# EAGLE design untitled (EAGLE 6.3)

## Sheet 1 of 2
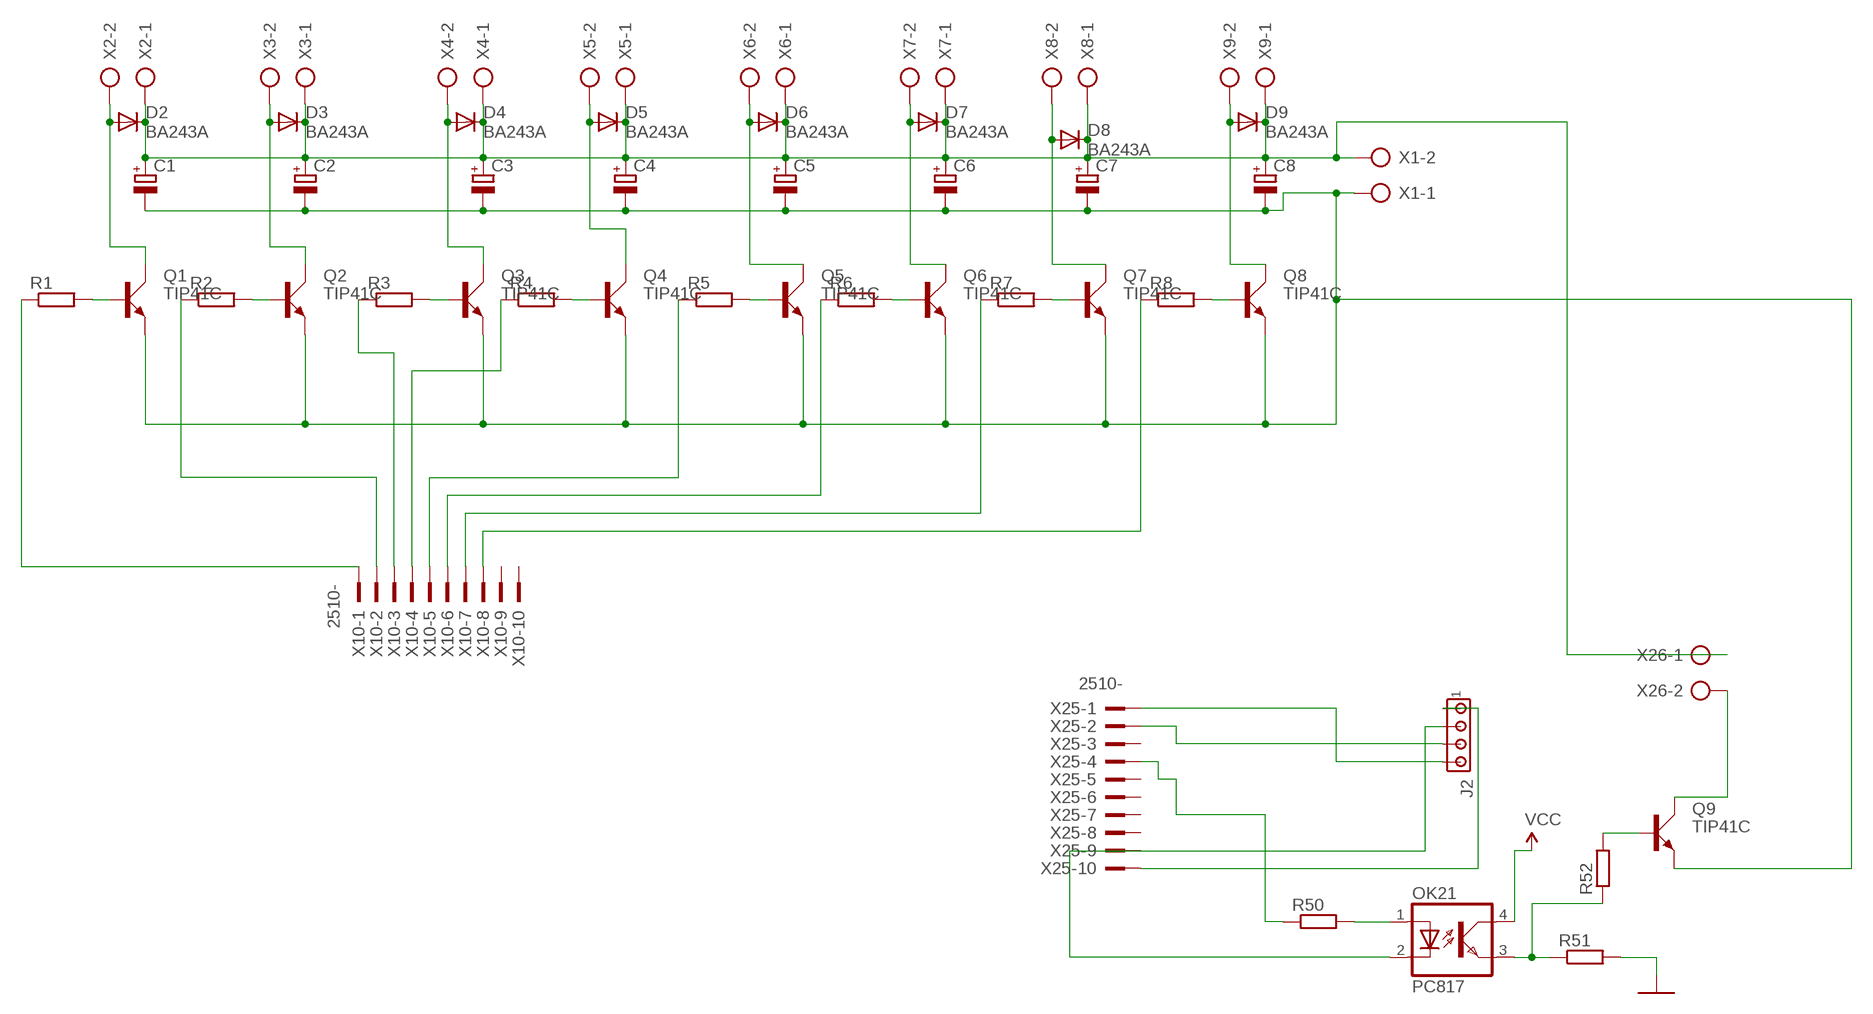
[diagram p0: schematic, sheet 1]

### Parts
C1  CPOL-EUE5-10.5  [E5-10,5]
C2  CPOL-EUE5-10.5  [E5-10,5]
C3  CPOL-EUE5-10.5  [E5-10,5]
C4  CPOL-EUE5-10.5  [E5-10,5]
C5  CPOL-EUE5-10.5  [E5-10,5]
C6  CPOL-EUE5-10.5  [E5-10,5]
C7  CPOL-EUE5-10.5  [E5-10,5]
C8  CPOL-EUE5-10.5  [E5-10,5]
D2  BA243A  [DO35-10]
D3  BA243A  [DO35-10]
D4  BA243A  [DO35-10]
D5  BA243A  [DO35-10]
D6  BA243A  [DO35-10]
D7  BA243A  [DO35-10]
D8  BA243A  [DO35-10]
D9  BA243A  [DO35-10]
J2  MTA04-100  [10X04MTA]
OK21  PC817  [DIL04]
Q1  TIP41C  [TO220AV]
Q2  TIP41C  [TO220AV]
Q3  TIP41C  [TO220AV]
Q4  TIP41C  [TO220AV]
Q5  TIP41C  [TO220AV]
Q6  TIP41C  [TO220AV]
Q7  TIP41C  [TO220AV]
Q8  TIP41C  [TO220AV]
Q9  TIP41C  [TO220AV]
R1  R-EU_0204/7  [0204/7]
R2  R-EU_0204/7  [0204/7]
R3  R-EU_0204/7  [0204/7]
R4  R-EU_0204/7  [0204/7]
R5  R-EU_0204/7  [0204/7]
R6  R-EU_0204/7  [0204/7]
R7  R-EU_0204/7  [0204/7]
R8  R-EU_0204/7  [0204/7]
R50  R-EU_0204/7  [0204/7]
R51  R-EU_0204/7  [0204/7]
R52  R-EU_0204/7  [0204/7]
X1  AK300/2  [AK300/2]
X2  AK300/2  [AK300/2]
X3  AK300/2  [AK300/2]
X4  AK300/2  [AK300/2]
X5  AK300/2  [AK300/2]
X6  AK300/2  [AK300/2]
X7  AK300/2  [AK300/2]
X8  AK300/2  [AK300/2]
X9  AK300/2  [AK300/2]
X10  2510-  [PAK100/2500-10]
X25  2510-  [PAK100/2500-10]
X26  AK300/2  [AK300/2]

### Nets
GND: R51.2 ; also sheet 2
N$1: Q1.B R1.2
N$2: Q2.B R2.2
N$3: Q3.B R3.2
N$4: Q4.B R4.2
N$5: Q5.B R5.2
N$6: Q7.B R7.2
N$7: Q8.B R8.2
N$8: Q6.B R6.2
N$10: D2.A Q1.C X2.2
N$11: D3.A Q2.C X3.2
N$12: D4.A Q3.C X4.2
N$13: D5.A Q4.C X5.2
N$14: D6.A Q5.C X6.2
N$15: D7.A Q6.C X7.2
N$16: D8.A Q7.C X8.2
N$17: D9.A Q8.C X9.2
N$18: C1.+ C2.+ C3.+ C4.+ C5.+ C6.+ C7.+ C8.+ D2.C D3.C D4.C D5.C D6.C D7.C D8.C D9.C X1.2 X2.1 X3.1 X4.1 X5.1 X6.1 X7.1 X8.1 X9.1 X26.1
N$19: R3.1 X10.3
N$20: R4.1 X10.4
N$21: R1.1 X10.1
N$22: R2.1 X10.2
N$23: R5.1 X10.5
N$24: R6.1 X10.6
N$25: R7.1 X10.7
N$26: R8.1 X10.8
N$149: J2.1 X25.10
N$150: J2.2 OK21.2(C) X25.9
N$151: J2.3 X25.2
N$152: J2.4 X25.1
N$153: OK21.1(A) R50.2
N$154: R50.1 X25.4
N$156: OK21.3(EMIT) R51.1 R52.1
N$157: Q9.B R52.2
N$159: Q9.C X26.2
N$160: C1.- C2.- C3.- C4.- C5.- C6.- C7.- C8.- Q1.E Q2.E Q3.E Q4.E Q5.E Q6.E Q7.E Q8.E Q9.E X1.1
VCC: OK21.4(COL) ; also sheet 2
Unconnected: X10.9 X10.10 X25.3 X25.5 X25.6 X25.7 X25.8

## Sheet 2 of 2
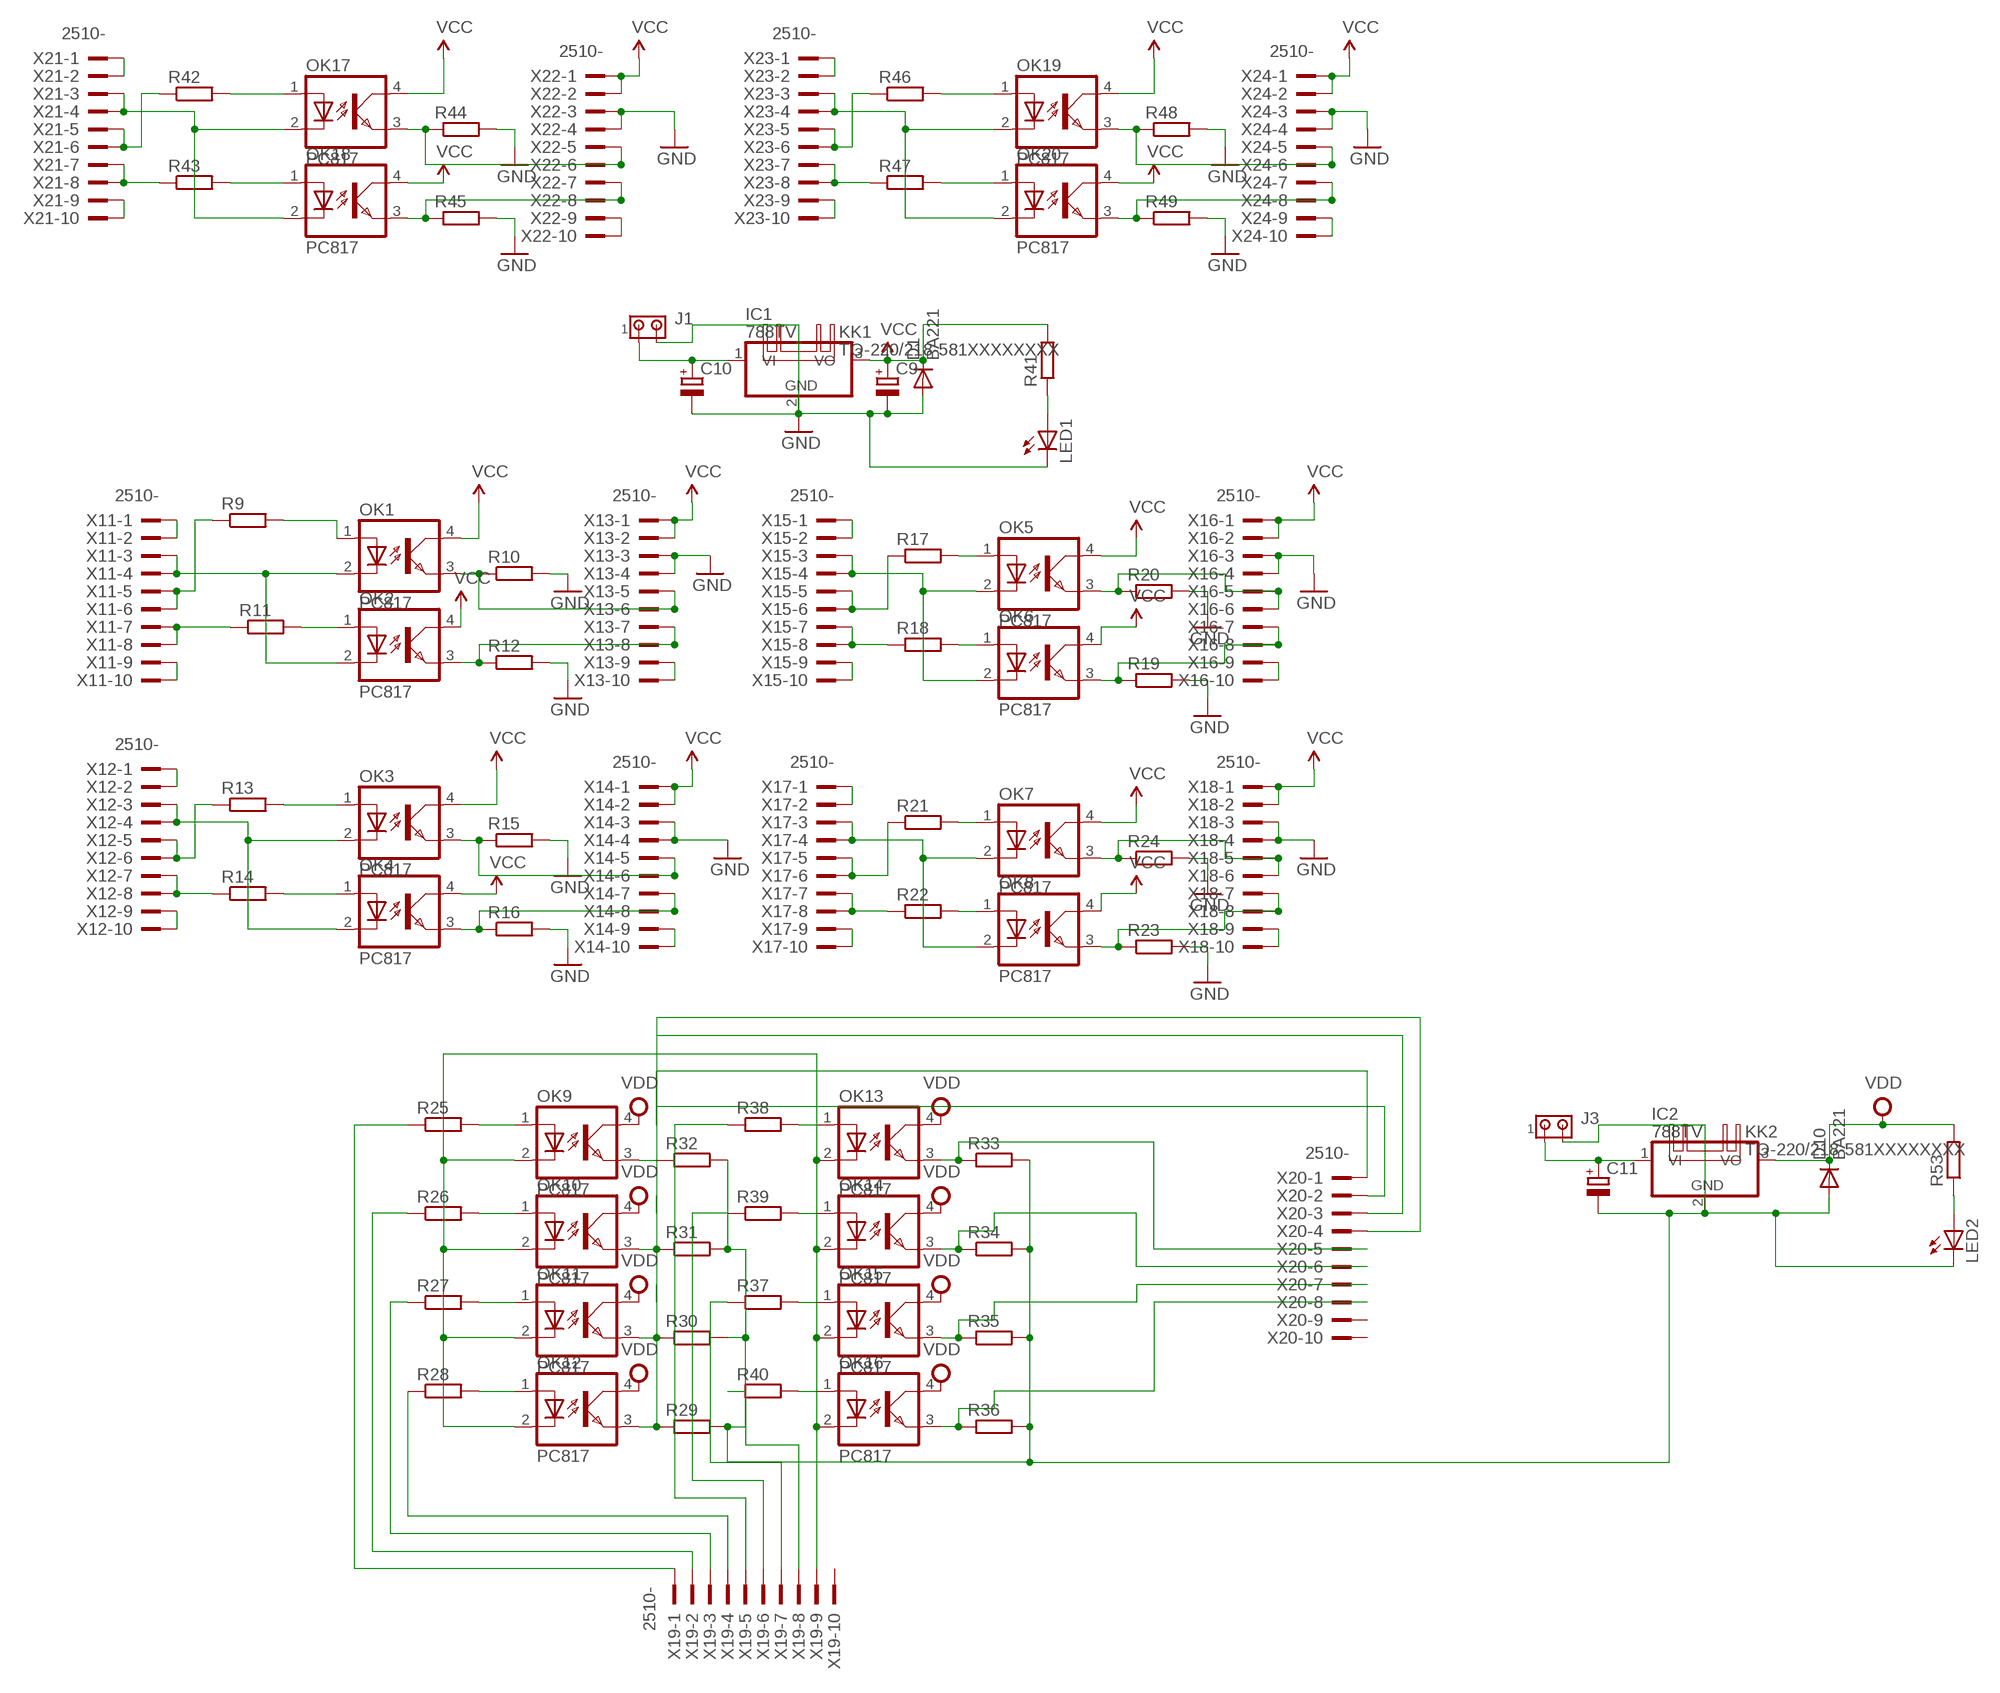
[diagram p1: schematic, sheet 2]

### Parts
C9  CPOL-EUE5-10.5  [E5-10,5]
C10  CPOL-EUE7.5-18  [E7,5-18]
C11  CPOL-EUE7.5-18  [E7,5-18]
D1  BA221  [DO35-10]
D10  BA221  [DO35-10]
IC1  788TV  [TO220V]
IC2  788TV  [TO220V]
J1  MTA02-156  [1X2MTA]
J3  MTA02-156  [1X2MTA]
KK1  TO-220/218-581XXXXXXXX  [581XXXXXXXX]
KK2  TO-220/218-581XXXXXXXX  [581XXXXXXXX]
LED1  LEDSFH480  [SFH480]
LED2  LEDSFH480  [SFH480]
OK1  PC817  [DIL04]
OK2  PC817  [DIL04]
OK3  PC817  [DIL04]
OK4  PC817  [DIL04]
OK5  PC817  [DIL04]
OK6  PC817  [DIL04]
OK7  PC817  [DIL04]
OK8  PC817  [DIL04]
OK9  PC817  [DIL04]
OK10  PC817  [DIL04]
OK11  PC817  [DIL04]
OK12  PC817  [DIL04]
OK13  PC817  [DIL04]
OK14  PC817  [DIL04]
OK15  PC817  [DIL04]
OK16  PC817  [DIL04]
OK17  PC817  [DIL04]
OK18  PC817  [DIL04]
OK19  PC817  [DIL04]
OK20  PC817  [DIL04]
R9  R-EU_0207/10  [0207/10]
R10  R-EU_0207/10  [0207/10]
R11  R-EU_0207/10  [0207/10]
R12  R-EU_0207/10  [0207/10]
R13  R-EU_0207/10  [0207/10]
R14  R-EU_0207/10  [0207/10]
R15  R-EU_0207/10  [0207/10]
R16  R-EU_0207/10  [0207/10]
R17  R-EU_0207/10  [0207/10]
R18  R-EU_0207/10  [0207/10]
R19  R-EU_0207/10  [0207/10]
R20  R-EU_0207/10  [0207/10]
R21  R-EU_0207/10  [0207/10]
R22  R-EU_0207/10  [0207/10]
R23  R-EU_0207/10  [0207/10]
R24  R-EU_0207/10  [0207/10]
R25  R-EU_0207/10  [0207/10]
R26  R-EU_0207/10  [0207/10]
R27  R-EU_0207/10  [0207/10]
R28  R-EU_0207/10  [0207/10]
R29  R-EU_0207/10  [0207/10]
R30  R-EU_0207/10  [0207/10]
R31  R-EU_0207/10  [0207/10]
R32  R-EU_0207/10  [0207/10]
R33  R-EU_0207/10  [0207/10]
R34  R-EU_0207/10  [0207/10]
R35  R-EU_0207/10  [0207/10]
R36  R-EU_0207/10  [0207/10]
R37  R-EU_0207/10  [0207/10]
R38  R-EU_0207/10  [0207/10]
R39  R-EU_0207/10  [0207/10]
R40  R-EU_0207/10  [0207/10]
R41  R-EU_0207/10  [0207/10]
R42  R-EU_0207/10  [0207/10]
R43  R-EU_0207/10  [0207/10]
R44  R-EU_0207/10  [0207/10]
R45  R-EU_0207/10  [0207/10]
R46  R-EU_0207/10  [0207/10]
R47  R-EU_0207/10  [0207/10]
R48  R-EU_0207/10  [0207/10]
R49  R-EU_0207/10  [0207/10]
R53  R-EU_0207/10  [0207/10]
X11  2510-  [PAK100/2500-10]
X12  2510-  [PAK100/2500-10]
X13  2510-  [PAK100/2500-10]
X14  2510-  [PAK100/2500-10]
X15  2510-  [PAK100/2500-10]
X16  2510-  [PAK100/2500-10]
X17  2510-  [PAK100/2500-10]
X18  2510-  [PAK100/2500-10]
X19  2510-  [PAK100/2500-10]
X20  2510-  [PAK100/2500-10]
X21  2510-  [PAK100/2500-10]
X22  2510-  [PAK100/2500-10]
X23  2510-  [PAK100/2500-10]
X24  2510-  [PAK100/2500-10]

### Nets
GND: C9.- C10.- D1.A IC1.2(GND) J1.2 LED1.K(C) R10.2 R12.2 R15.2 R16.2 R19.2 R20.2 R23.2 R24.2 R44.2 R45.2 R48.2 R49.2 X13.3 X13.4 X14.3 X14.4 X16.3 X16.4 X18.3 X18.4 X22.3 X22.4 X24.3 X24.4 ; also sheet 1
N$9: X11.1 X11.2
N$27: R9.1 X11.5 X11.6
N$28: R11.1 X11.7 X11.8
N$29: X11.9 X11.10
N$31: X12.1 X12.2
N$32: R13.1 X12.5 X12.6
N$33: R14.1 X12.7 X12.8
N$34: X12.9 X12.10
N$41: OK1.1(A) R9.2
N$42: OK2.1(A) R11.2
N$60: OK1.2(C) OK2.2(C) X11.3 X11.4
N$61: OK2.3(EMIT) R12.1 X13.7 X13.8
N$62: X13.9 X13.10
N$63: OK3.1(A) R13.2
N$64: OK4.1(A) R14.2
N$65: OK3.2(C) OK4.2(C) X12.3 X12.4
N$66: OK3.3(EMIT) R15.1 X14.5 X14.6
N$67: OK4.3(EMIT) R16.1 X14.7 X14.8
N$68: X14.9 X14.10
N$69: OK5.1(A) R17.2
N$70: OK6.1(A) R18.2
N$71: X15.1 X15.2
N$72: R17.1 X15.5 X15.6
N$73: R18.1 X15.7 X15.8
N$74: X15.9 X15.10
N$75: OK5.2(C) OK6.2(C) X15.3 X15.4
N$76: OK5.3(EMIT) R20.1 X16.5 X16.6
N$77: OK6.3(EMIT) R19.1 X16.7 X16.8
N$78: X16.9 X16.10
N$79: OK7.1(A) R21.2
N$80: OK8.1(A) R22.2
N$81: X17.1 X17.2
N$82: R21.1 X17.5 X17.6
N$83: R22.1 X17.7 X17.8
N$84: X17.9 X17.10
N$85: OK7.2(C) OK8.2(C) X17.3 X17.4
N$86: OK7.3(EMIT) R24.1 X18.5 X18.6
N$87: OK8.3(EMIT) R23.1 X18.7 X18.8
N$88: X18.9 X18.10
N$89: R25.1 X19.1
N$90: OK9.1(A) R25.2
N$91: R26.1 X19.2
N$92: R27.1 X19.3
N$93: R28.1 X19.4
N$94: OK12.1(A) R28.2
N$95: OK11.1(A) R27.2
N$96: OK10.1(A) R26.2
N$97: OK9.2(C) OK10.2(C) OK11.2(C) OK12.2(C) OK13.2(C) OK14.2(C) OK15.2(C) OK16.2(C) X19.9
N$98: X20.1
N$99: OK10.3(EMIT) R31.1 X20.2
N$100: OK11.3(EMIT) R30.1 X20.3
N$101: OK12.3(EMIT) R29.1 X20.4
N$102: OK13.1(A) R38.2
N$103: OK14.1(A) R39.2
N$104: OK15.1(A) R37.2
N$105: OK16.1(A) R40.2
N$106: R38.1 X19.5
N$107: R39.1 X19.6
N$108: R37.1 X19.7
N$109: R40.1 X19.8
N$110: OK15.3(EMIT) R35.1 X20.7
N$111: OK16.3(EMIT) R36.1 X20.8
N$112: OK14.3(EMIT) R34.1 X20.6
N$113: OK13.3(EMIT) R33.1 X20.5
N$114: C10.+ IC1.1(VI) J1.1
N$115: LED1.A R41.1
N$116: OK1.3(EMIT) R10.1 X13.5 X13.6
N$117: X21.1 X21.2
N$118: R42.1 X21.5 X21.6
N$119: R43.1 X21.7 X21.8
N$120: X21.9 X21.10
N$121: OK17.1(A) R42.2
N$122: OK18.1(A) R43.2
N$123: OK17.2(C) OK18.2(C) X21.3 X21.4
N$124: OK17.3(EMIT) R44.1 X22.5 X22.6
N$125: OK18.3(EMIT) R45.1 X22.7 X22.8
N$126: X22.9 X22.10
N$127: X23.1 X23.2
N$128: R46.1 X23.5 X23.6
N$129: R47.1 X23.7 X23.8
N$130: X23.9 X23.10
N$131: OK19.1(A) R46.2
N$132: OK20.1(A) R47.2
N$133: OK19.2(C) OK20.2(C) X23.3 X23.4
N$134: OK19.3(EMIT) R48.1 X24.5 X24.6
N$135: OK20.3(EMIT) R49.1 X24.7 X24.8
N$136: X24.9 X24.10
N$137: C11.+ IC2.1(VI) J3.1
N$155: LED2.A R53.1
N$162: OK9.3(EMIT) R32.1
N$165: C11.- D10.A IC2.2(GND) J3.2 LED2.K(C) R29.2 R30.2 R31.2 R32.2 R33.2 R34.2 R35.2 R36.2
VCC: C9.+ D1.C IC1.3(VO) OK1.4(COL) OK2.4(COL) OK3.4(COL) OK4.4(COL) OK5.4(COL) OK6.4(COL) OK7.4(COL) OK8.4(COL) OK17.4(COL) OK18.4(COL) OK19.4(COL) OK20.4(COL) R41.2 X13.1 X13.2 X14.1 X14.2 X16.1 X16.2 X18.1 X18.2 X22.1 X22.2 X24.1 X24.2 ; also sheet 1
VDD: D10.C IC2.3(VO) OK9.4(COL) OK10.4(COL) OK11.4(COL) OK12.4(COL) OK13.4(COL) OK14.4(COL) OK15.4(COL) OK16.4(COL) R53.2
Unconnected: X19.10 X20.9 X20.10

## Library data of the parts
C1-C8 = rcl:CPOL-EU: POLARIZED CAPACITOR, European symbol
C9-C11 = qfm-trx1-24g:CPOL-EU: POLARIZED CAPACITOR, European symbol
D1 D10 = diode:BA221: DIODE high speed (Philips)
D2-D9 = diode:BA243A: DIODE
IC1 IC2 = linear:78*: Positive VOLTAGE REGULATOR Source: http://cache.national.com/ds/LM/LM78L05.pdf http://www.fairchildsemi.com/ds/LM/LM7805.pdf
J1 J3 = con-amp:MTA02-156: AMP connector
J2 = con-amp:MTA04-100: AMP connector
KK1 KK2 = heatsink-aavid:TO-220/218: HEATSINKS TO-220/218
LED1 LED2 = adafruit:LED: LED OSRAM: - CHIPLED LG R971, LG N971, LY N971, LG Q971, LY Q971, LO R971, LY R971 LH N974, LH R974 LS Q976, LO Q976, LY Q976 LO Q996 - Hyper CHIPLED LW Q18S LB Q993, LB Q99A, LB R99A - SideLED LS A670, LO A670, LY A670, LG A670, LP A670 LB A673, LV A673, LT A673, LW A673 LH A674 LY A675 LS A676, LA A676, LO A676, LY A676, LW A676 LS A679, LY A679, LG A679 - Hyper Micro SIDELED® LS Y876, LA Y876, LO Y876, LY Y876 LT Y87S - SmartLED LW L88C, LW L88S LB L89C, LB L89S, LG L890 LS L89K, LO L89K, LY L89K LS L896, LA L896, LO L896, LY L896 - TOPLED LS T670, LO T670, LY T670, LG T670, LP T670 LSG T670, LSP T670, LSY T670, LOP T670, LYG T670 LG T671, LOG T671, LSG T671 LB T673, LV T673, LT T673, LW T673 LH T674 LS T676, LA T676, LO T676, LY T676, LB T676, LH T676, LSB T676, LW T676 LB T67C, LV T67C, LT T67C, LS T67K, LO T67K, LY T67K, LW E67C LS E67B, LA E67B, LO E67B, LY E67B, LB E67C, LV E67C, LT E67C LW T67C LS T679, LY T679, LG T679 LS T770, LO T770, LY T770, LG T770, LP T770 LB T773, LV T773, LT T773, LW T773 LH T774 LS E675, LA E675, LY E675, LS T675 LS T776, LA T776, LO T776, LY T776, LB T776 LHGB T686 LT T68C, LB T68C - Hyper Mini TOPLED® LB M676 - Mini TOPLED Santana® LG M470 LS M47K, LO M47K, LY M47K Source: http://www.osram.convergy.de/
OK1-OK21 = optocoupler:PC817: SHARP OPTO COUPLER; MPN: PC817X4J000F; OC_FARNELL: 9707727; OC_NEWARK: 97K7059
Q1-Q9 = transistor-power:TIP41C: NPN TRANSISTOR
R1-R53 = rcl:R-EU_: RESISTOR, European symbol
X1-X9 X26 = con-ptr500:AK300/2: CONNECTOR
X10-X25 = con-3m:2510-: 3M (TM) Pak 100 4-Wall Header Source: 3M; MF: 3M; MPN: 2510-6002UB; OC_FARNELL: 9838244; OC_NEWARK: 46F4725

## Board
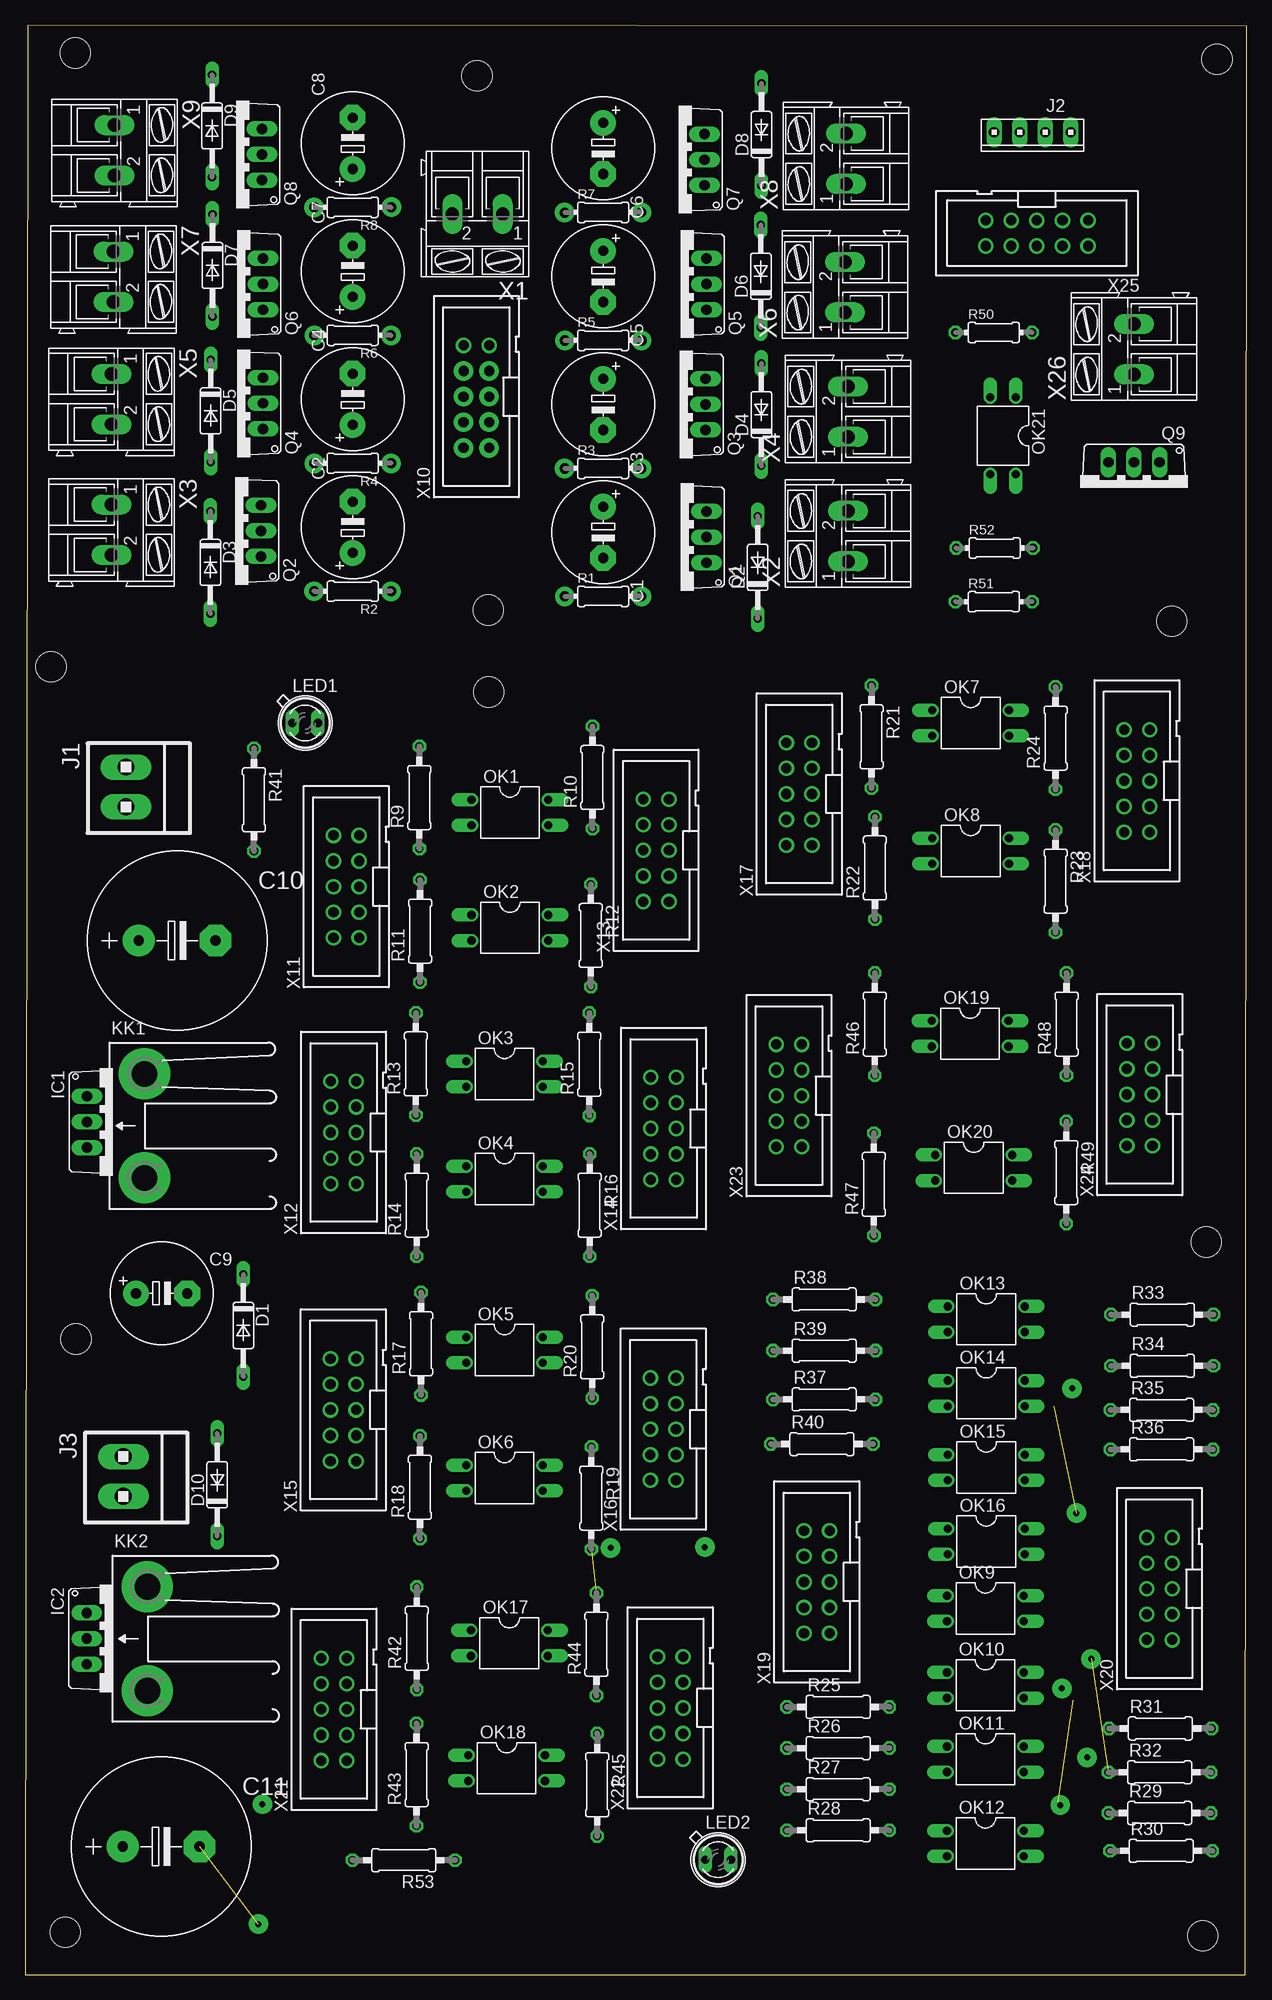
[diagram p2: board, top side]
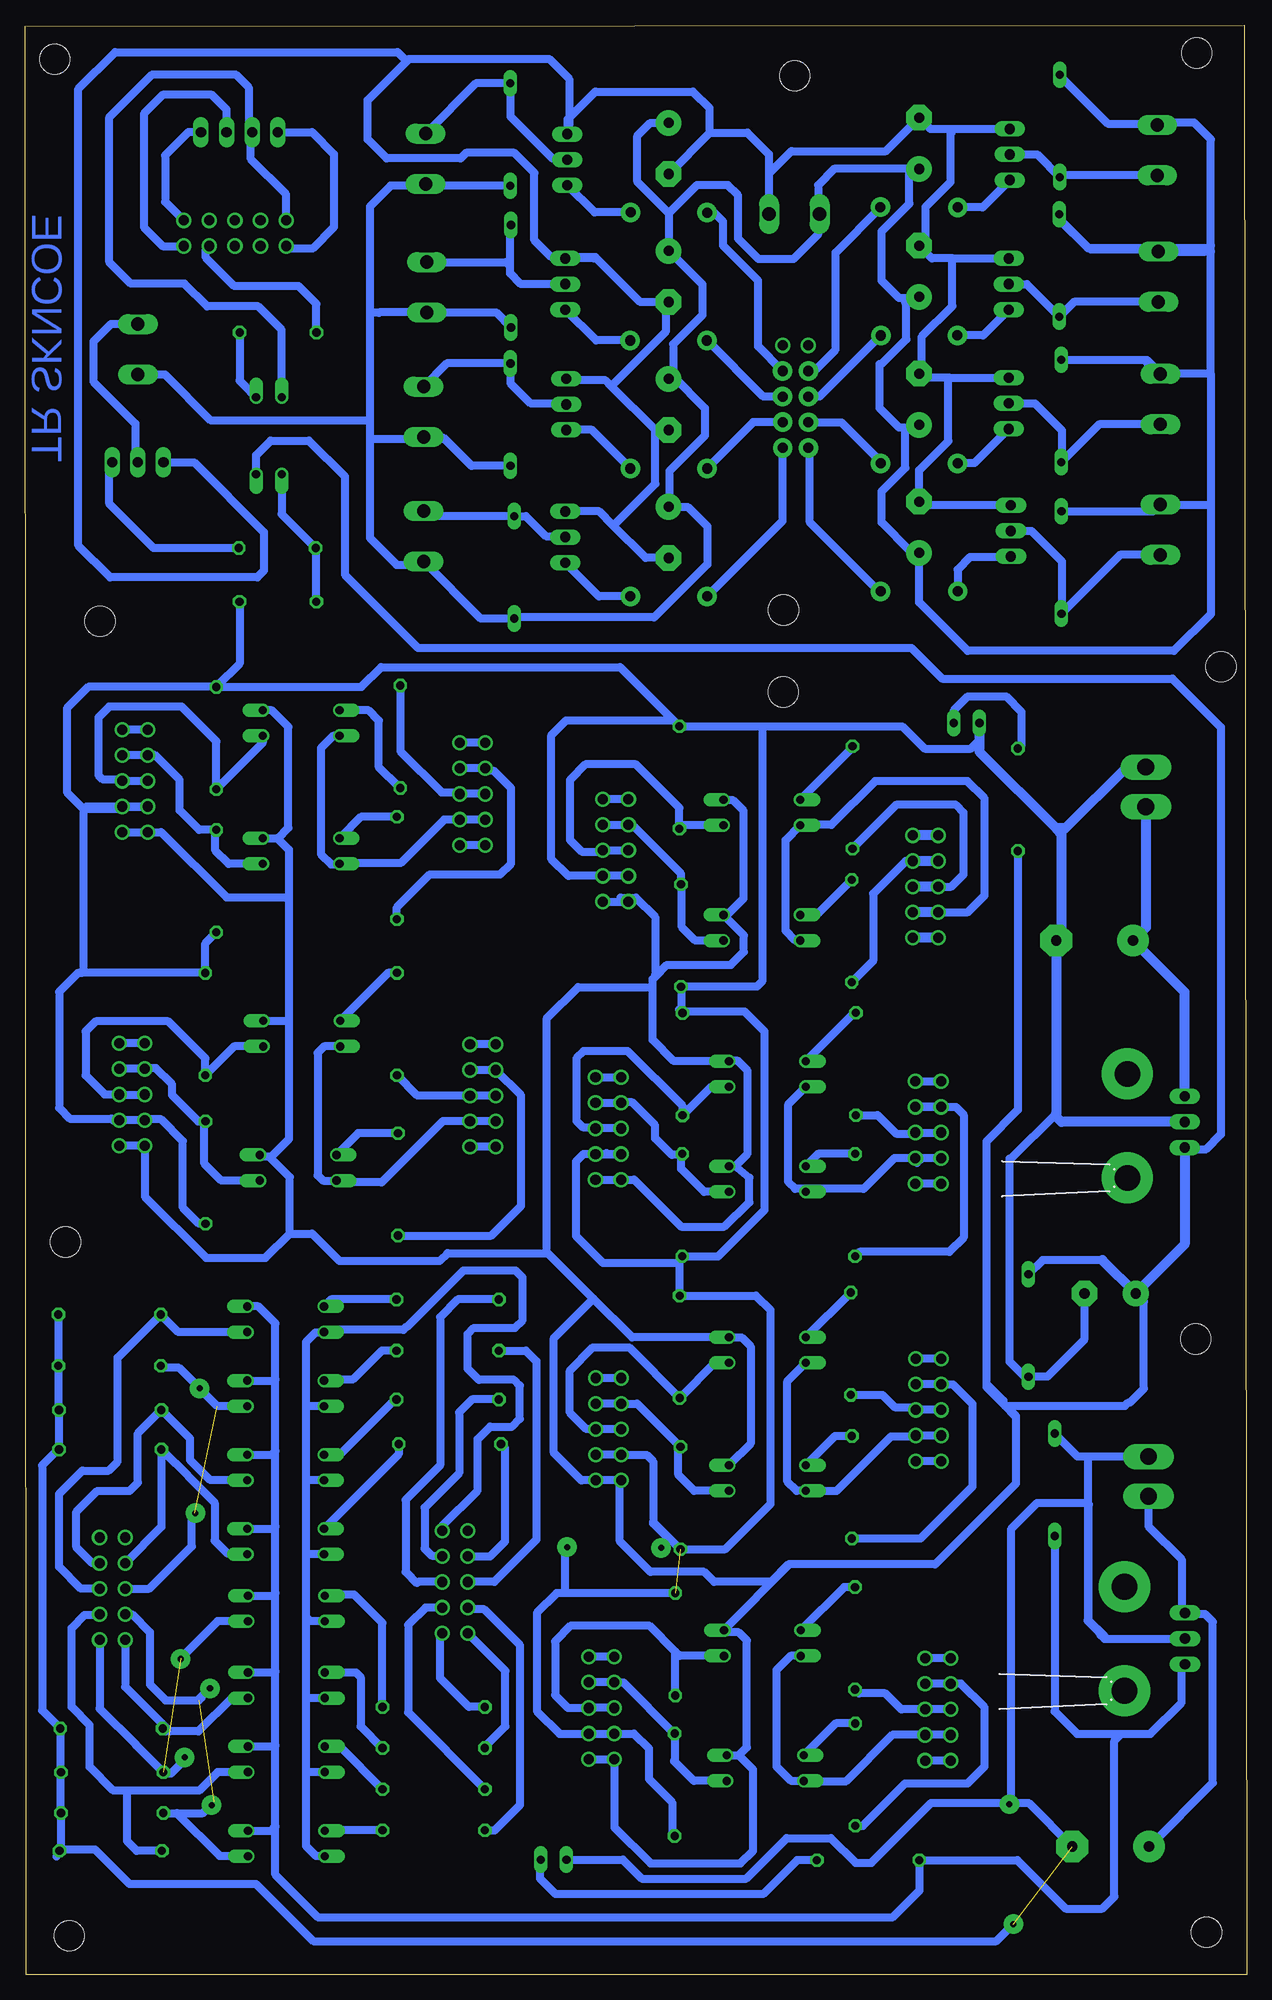
[diagram p3: board, bottom side, seen from below]

Size 121.2 x 193.46 mm. Coordinates in mm from the lower left corner, seen from the top.
Outline: 0,0 121.08,0.03 121.2,193.36 0.25,193.46 0,0
Copper layers (1*16): Top 0.035mm / dielectric 1.5mm / Bottom 0.035mm
Design rules "default": minimum track width 10mil, minimum drill 24mil, track to track 8mil, track to pad 8mil, pad to pad 8mil, via to via 8mil, smd to smd 8mil, copper to edge 40mil, drill to drill 8mil, minimum pad ring 10mil, minimum via ring 8mil, stop-mask expansion 4mil, vias tented up to drill 0mil, thermal gap 10mil
Holes 3 mm at 44.83,188.46 45.95,135.43 113.78,134.31 4.96,190.7 3.98,4.23 116.84,3.87 2.55,129.8 45.99,127.3 118.26,190.09 117.19,72.72 5.05,63.09

### Footprints (pad centres in the part's own frame; a part is rotated, then mirrored left to right if it is on the bottom)
E5-10,5 = drill 1.016 pad 2.54: + -2.54,0 | drill 1.016 pad 2.54 octagon: - 2.54,0
E7,5-18 = drill 1.016 pad 3.15: + -3.81,0 | drill 1.016 pad 3.15 octagon: - 3.81,0
DO35-10 = drill 0.813 long: A 5.08,0; C -5.08,0
TO220V = drill 1.016 long: 1 -2.54,-2.54; 2 0,-2.54; 3 2.54,-2.54
1X2MTA = drill 1.676 long: 1 1.981,0; 2 -1.981,0
10X04MTA = drill 1.016 long: 1 3.81,0; 2 1.27,0; 3 -1.27,0; 4 -3.81,0
581XXXXXXXX = drill 2.54 pad 5.08: A2,5 -5.16,3.45; B2,5 5.16,3.45
SFH480 = drill 0.813 long: A 1.27,0; K -1.27,0
DIL04 = drill 0.813 offset: 1 -1.27,-3.81; 2 1.27,-3.81; 3 1.27,3.81; 4 -1.27,3.81
TO220AV = drill 1.016 long: B -2.54,-2.54; C 0,-2.54; E 2.54,-2.54
0204/7 = drill 0.813 octagon: 1 -3.81,0; 2 3.81,0
0207/10 = drill 0.813 octagon: 1 -5.08,0; 2 5.08,0
AK300/2 = drill 1.321 long: 1 -2.515,0; 2 2.489,0
PAK100/2500-10 = drill 1 pad 1.422: 1 -5.08,-1.27; 2 -5.08,1.27; 3 -2.54,-1.27; 4 -2.54,1.27; 5 0,-1.27; 6 0,1.27; 7 2.54,-1.27; 8 2.54,1.27; 9 5.08,-1.27; 10 5.08,1.27

### Placement (x,y rotation side)
C1  57.35,143.13 270 top
C2  32.49,143.64 90 top
C3  57.35,155.83 270 top
C4  32.49,156.34 90 top
C5  57.35,168.53 270 top
C6  57.35,181.23 270 top
C7  32.49,169.04 90 top
C8  32.49,181.74 90 top
C9  13.54,67.61 0 top
C10  15.08,102.63 0 top
C11  13.49,12.72 0 top
D1  21.65,64.43 270 top
D2  72.69,139.66 90 top
D3  18.38,140.15 270 top
D4  73.05,154.82 90 top
D5  18.4,155.18 270 top
D6  73,168.55 90 top
D7  18.58,169.62 270 top
D8  73.06,182.61 90 top
D9  18.55,183.46 270 top
D10  19.05,48.63 90 top
IC1  8.68,84.63 270 top
IC2  8.65,33.37 270 top
J1  10,117.87 270 top
J2  99.95,182.84 180 top
J3  9.74,49.45 270 top
KK1  8.38,84.24 270 top
KK2  8.67,33.34 270 top
LED1  27.78,124.22 0 top
LED2  68.76,11.43 0 top
OK1  48.1,115.33 270 top
OK2  48.1,103.9 270 top
OK3  47.56,89.39 270 top
OK4  47.56,78.96 270 top
OK5  47.56,61.99 270 top
OK6  47.56,49.29 270 top
OK7  93.82,124.22 270 top
OK8  93.82,111.52 270 top
OK9  95.29,36.36 270 top
OK10  95.29,28.74 270 top
OK11  95.29,21.39 270 top
OK12  95.29,13.04 270 top
OK13  95.36,65.05 270 top
OK14  95.36,57.7 270 top
OK15  95.36,50.35 270 top
OK16  95.36,43 270 top
OK17  48.04,32.91 270 top
OK18  47.77,20.51 270 top
OK19  93.76,93.39 270 top
OK20  94.12,80.09 270 top
OK21  97.02,152.73 180 top
Q1  65.07,142.67 90 top
Q2  20.86,143.28 90 top
Q3  64.97,155.83 90 top
Q4  21.06,155.94 90 top
Q5  65.07,167.77 90 top
Q6  21.06,167.77 90 top
Q7  64.87,180.12 90 top
Q8  20.96,180.63 90 top
Q9  110.03,147.55 180 top
R1  57.35,136.78 0 top
R2  32.49,137.29 180 top
R3  57.35,149.48 0 top
R4  32.49,149.99 180 top
R5  57.35,162.18 0 top
R6  32.49,162.69 180 top
R7  57.35,174.88 0 top
R8  32.49,175.39 180 top
R9  39.12,116.82 90 top
R10  56.29,118.81 90 top
R11  39.18,103.57 90 top
R12  56.13,103.13 270 top
R13  38.77,90.38 90 top
R14  38.85,76.38 90 top
R15  55.97,90.36 90 top
R16  56.01,76.38 270 top
R17  39.28,62.62 90 top
R18  39.17,48.38 90 top
R19  56.18,47.31 270 top
R20  56.26,62.31 90 top
R21  83.98,122.85 270 top
R22  84.32,109.83 90 top
R23  102.24,108.53 270 top
R24  102.24,122.72 90 top
R25  80.67,26.58 0 top
R26  80.67,22.5 0 top
R27  80.67,18.42 0 top
R28  80.67,14.34 0 top
R29  112.57,16.06 0 top
R30  112.72,12.31 0 top
R31  112.65,24.44 0 top
R32  112.57,20.1 0 top
R33  112.83,65.52 0 top
R34  112.83,60.44 0 top
R35  112.77,56.06 0 top
R36  112.77,52.14 0 top
R37  79.28,57.1 0 top
R38  79.28,67.02 0 top
R39  79.28,61.94 0 top
R40  79.06,52.67 0 top
R41  22.7,116.6 270 top
R42  38.86,33.39 90 top
R43  38.83,19.87 90 top
R44  56.69,32.81 90 top
R45  56.76,18.86 270 top
R46  84.3,94.34 90 top
R47  84.22,78.43 90 top
R48  103.34,94.34 90 top
R49  103.31,79.61 270 top
R50  96.11,162.97 0 top
R51  96.12,136.25 0 top
R52  96.19,141.58 0 top
R53  37.57,11.37 180 top
X1  44.87,174.71 180 top
X2  81.66,142.77 90 top
X3  8.56,143.38 270 top
X4  81.66,155.12 90 top
X5  8.56,156.34 270 top
X6  81.36,167.47 90 top
X7  8.77,168.49 270 top
X8  81.46,180.22 90 top
X9  8.87,181.04 270 top
X10  44.77,156.6 90 top
X11  31.86,107.98 90 top
X12  31.59,83.58 90 top
X13  62.61,111.58 90 top
X14  63.34,83.98 90 top
X15  31.56,56.05 90 top
X16  63.31,54.14 90 top
X17  76.81,117.17 90 top
X18  110.31,118.47 90 top
X19  78.55,38.98 90 top
X20  112.55,38.31 90 top
X21  30.64,26.34 90 top
X22  64.01,26.48 90 top
X23  75.79,87.24 90 top
X24  110.6,87.35 90 top
X25  100.39,172.82 180 top
X26  110.03,161.32 90 top

### Tracks (layer width: path | path; a pad name or v marks a point on that pad's centre or on a via)
GND  (1 unrouted)
  Bottom 0.813: 47.92,123.89 R10.2 56.88,124.48 | 47.92,123.89 34.18,123.89 31.96,121.67 27.36,121.67 26.51,122.52 | 47.92,123.89 48.02,123.8 48.02,98.65 48.6,98.07 56.11,98.07 R12.2 56.13,95.6 R15.2 | 16.13,67.61 16.13,63 19.77,59.36 D1.A 22.03,59.35 23.55,60.87 23.55,81.01 23.34,81.01 18.89,85.46 | 56.31,95.78 R15.2 | R15.2 55.85,95.57 49.81,95.57 47.83,93.59 47.83,75.91 52.43,71.3 R16.2 56.26,71.05 56.26,70.88 | 56.26,70.88 R20.2 48.69,67.39 47.27,65.98 47.27,46.7 51.74,42.23 R19.2 58.88,44.93 | R24.2 87.84,127.8 85.87,129.77 62.17,129.77 56.88,124.48 | X16.3 X16.4 59.53,51.6 58.88,50.95 58.88,44.93 | X13.3 X13.4 67.31,109.04 68.98,110.72 68.98,123.02 67.52,124.48 56.88,124.48 | X14.3 X14.4 | X14.4 63.4,81.44 63.52,81.55 | R45.2 57.01,14.03 57.01,17.12 59.33,19.44 59.33,22.47 60.79,23.94 X22.4 X22.3 65.32,23.9 68.18,23.9 70.44,26.16 70.44,35.93 68.48,37.89 R44.2 67.56,37.89 67.6,37.93 67.6,42.11 67.68,42.19 | R49.2 103.97,74.53 105.56,76.13 105.56,82.73 107.71,84.88 109.26,84.88 X24.4 X24.3 111.91,84.77 112.43,84.77 112.63,84.96 116.78,84.96 117.84,86.03 117.84,97.53 115.96,99.42 115.62,99.42 | X14.4 65.82,81.44 66.57,80.69 66.57,73.31 63.89,70.64 56.51,70.64 56.26,70.88 | R24.2 114.94,127.8 117.07,125.67 117.07,117.35 115.43,115.71 111.8,115.71 X18.3 X18.4 115.11,115.93 115.43,115.62 115.43,99.61 115.62,99.42 | R23.2 103.34,102.36 R48.2 115.62,99.42 | 58.88,44.93 58.88,44.79 57.6,43.51 57.6,43.01 58.26,42.36 | R51.2 99.93,130.11 R24.2
  Bottom 1.016: C9.- 16.13,67.61 | IC1.2 18.38,84.63 18.89,85.14 18.89,85.46 C10.- 18.38,103.14 18.38,113.24 18.79,113.65 | LED1.K 26.51,122.52 26.51,121.37 18.79,113.65 | J1.2 11.92,119.85 18.01,113.76 18.69,113.76 18.79,113.65
N$1
  Bottom 0.813: R1.2 64.27,136.78 Q1.B
N$2
  Bottom 0.813: R2.2 28.68,139.45 27.46,140.67 23.47,140.67 Q2.B
N$3
  Bottom 0.813: Q3.B 64.97,153.29 R3.2
N$4
  Bottom 0.813: R4.2 27,149.99 Q4.B
N$5
  Bottom 0.813: R5.2 64.56,162.18 Q5.B
N$6
  Bottom 0.813: R7.2 64.71,174.88 Q7.B
N$7
  Bottom 0.813: R8.2 26.2,175.39 Q8.B
N$8
  Bottom 0.813: R6.2 26.14,162.69 Q6.B
N$9
  Bottom 1.016: X11.2 X11.1
N$10
  Bottom 0.813: X2.2 81.15,144.74 D2.A 71.52,144.74 69.53,142.75 67.7,142.75 Q1.C
N$11
  Bottom 0.813: X3.2 12.56,140.89 17.99,135.47 | 17.99,135.47 D3.A | Q2.C 21.36,143.28 18.33,140.25 18.33,135.81 17.99,135.47
N$12
  Bottom 0.813: Q3.C 67.59,155.91 68.42,155.91 68.48,155.97 71.09,155.97 73.05,157.93 D4.A 79.37,159.9 X4.2
N$13
  Bottom 0.813: X5.2 14.65,153.85 D5.A 18.44,150.14 18.44,150.69 18.33,150.81 18.33,153.25 21.02,155.94 Q4.C
N$14
  Bottom 0.813: Q5.C 72.02,167.77 73.09,168.84 73.09,169.57 | 73.09,169.57 73.09,173.55 D6.A | X6.2 73.48,169.96 73.09,169.57
N$15
  Bottom 0.813: Q6.C 21.82,167.77 D7.A 17.13,166 X7.2
N$16
  Bottom 0.813: X8.2 76.48,187.69 D8.A 73.06,184.42 68.89,180.24 67.53,180.24 Q7.C
N$17
  Bottom 0.813: X9.2 18.38,178.55 D9.A 20.79,180.63 Q8.C
N$18
  Bottom 0.813: 57.35,174.81 C5.+ 54.02,167.74 54.02,164.69 56.9,161.81 56.9,158.61 | C6.+ 59.17,183.77 60.45,182.5 60.45,177.9 57.35,174.81 | C3.+ 57.14,158.37 56.9,158.61 | 33.26,179.2 C8.+ | 33.87,166.38 32.62,166.38 C7.+ | 33.87,166.38 34.48,166.38 36.22,168.11 36.22,173.01 33.47,175.76 33.47,179 33.26,179.2 | 33.98,153.52 32.77,153.52 C4.+ | 33.98,153.52 34.48,153.52 36.42,155.46 36.42,159.85 36.22,159.85 33.77,162.3 33.77,165.77 33.87,165.87 33.87,166.38 | C2.+ 32.67,141.28 33.36,141.28 36.22,144.13 36.22,147.2 33.87,149.55 33.87,153.42 33.98,153.52 | 57.35,174.81 54.56,177.6 51.49,177.6 50.47,176.58 50.47,172.29 48.43,170.25 44.98,170.25 42.53,172.7 42.53,174.57 X1.2 42.53,174.86 42.53,177.6 40.92,179.2 33.26,179.2 | 57.29,145.67 55.47,145.67 53.52,143.73 53.52,139.97 58.78,134.71 72.57,134.71 D2.C 75.99,134.58 X2.1 | 57.29,145.67 C1.+ | 81.35,140.57 X2.1 | 57.29,145.67 57.29,149.21 53.76,152.74 53.76,155.47 56.9,158.61 | D4.C 76.91,149.74 | 76.91,149.74 79.7,152.52 81.58,152.52 X4.1 | D8.C 81.28,177.53 | 81.28,177.53 X8.1 | D6.C 74.49,164.95 X6.1 86.07,164.95 86.11,164.91 87,164.91 | D3.C 9.23,145.23 X3.1 3.57,145.9 3.55,145.92 | D5.C 9.9,160.26 | 9.9,160.26 9,159.36 9,159.29 X5.1 | 3.55,158.8 3.55,171.02 | 3.55,171.02 3.55,171.58 | 3.55,171.58 3.55,182.13 5.22,183.8 8.63,183.8 X9.1 9,183.69 13.77,183.69 18.55,188.46 D9.C | 3.55,171.58 4.13,171 X7.1 9.01,171.24 15.55,171.24 18.58,174.28 D7.C 18.58,174.17 15.77,171.36 3.88,171.36 3.55,171.02 | 9.9,160.26 9.9,159.93 8.88,158.91 3.66,158.91 3.55,158.8 | 3.55,158.8 3.55,145.92 | 3.55,145.92 3.55,135.03 7.22,131.37 27.69,131.37 32.5,136.18 C2.+
  Bottom 0.813: 32.55,141.04 C2.+ | 81.28,177.53 84.93,177.53 87,175.47 87,164.91 | 87,164.91 87,154.27 | 87,154.27 87,152.14 | 87,152.14 87,142.59 84.34,139.92 82,139.92 X2.1 | 76.91,149.74 76.94,149.74 79.56,152.36 86.78,152.36 87,152.14 | X26.1 107.35,158.8 102.82,154.27 87,154.27
N$19
  Bottom 0.813: X10.3 48.96,154.06 R3.1
N$20
  Bottom 0.813: R4.1 36.3,150.15 40.19,154.03 43.47,154.03 X10.4
N$21
  Bottom 0.813: X10.1 46.04,144.29 R1.1
N$22
  Bottom 0.813: R2.1 36.5,137.29 43.34,144.14 43.34,151.37 X10.2
N$23
  Bottom 0.813: X10.5 47.96,156.6 R5.1
N$24
  Bottom 0.813: X10.6 42.39,156.6 R6.1
N$25
  Bottom 0.813: X10.7 48.48,161.58 48.48,168.11 51.94,171.58 51.94,173.96 52.86,174.88 R7.1
N$26
  Bottom 0.813: X10.8 42.93,159.14 40.8,161.28 40.8,170.9 R8.1 36.36,175.46
N$27
  Bottom 0.813: X11.5 29.29,107.98 28.08,109.19 28.08,115.33 28.84,116.09 34.77,116.09 R9.1
  Bottom 1.016: X11.6 X11.5
N$28
  Bottom 0.813: X11.7 33.83,110.52 37.06,107.3 37.06,100.62 R11.1
  Bottom 1.016: X11.8 X11.7
N$29
  Bottom 1.016: X11.10 X11.9
N$30  (via drill 1 pad 1.93)
  other vias: 28.7,162.68
N$31
  Bottom 0.813: X12.2 X12.1
N$32
  Bottom 0.813: X12.6 X12.5 32.97,83.47 34.79,83.47 36.62,85.3 R13.1
N$33
  Bottom 0.813: X12.8 X12.7 28.84,86.12 28.08,85.36 28.08,73.16 29.5,71.75 38.41,71.75 R14.1
N$34
  Bottom 0.813: X12.9 X12.10
N$35  (via drill 1 pad 1.93)
  other vias: 36.34,175.4
N$36  (via drill 1 pad 1.93)
  other vias: 36.29,162.67
N$37  (via drill 1 pad 1.93)
  other vias: 28.68,149.99
N$38  (via drill 1 pad 1.93)
  other vias: 36.31,149.99
N$39  (via drill 1 pad 1.93)
  other vias: 28.66,137.29
N$40  (via drill 1 pad 1.93)
  other vias: 53.56,162.17
N$41
  Bottom 0.813: R9.2 39.12,121.78 OK1.1
N$42
  Bottom 0.813: OK2.1 42.67,105.17 R11.2
N$43  (via drill 1 pad 1.93)
  other vias: 53.53,174.87
N$44  (via drill 1 pad 1.93)
  other vias: 61.14,174.88
N$45  (via drill 1 pad 1.93)
  other vias: 61.17,162.17
N$46  (via drill 1 pad 1.93)
  other vias: 61.15,149.48
N$47  (via drill 1 pad 1.93)
  other vias: 61.15,136.78
N$48  (via drill 1 pad 1.93)
  other vias: 53.54,136.79
N$49  (via drill 1 pad 1.93)
  other vias: 53.53,149.48
N$50  (via drill 1 pad 1.93)
  other vias: 28.66,175.38
N$51  (via drill 1 pad 1.93)
  other vias: 36.32,137.27
N$52  (via drill 1 pad 1.93)
  other vias: 43.49,151.52
N$53  (via drill 1 pad 1.93)
  other vias: 46.03,151.52
N$54  (via drill 1 pad 1.93)
  other vias: 46.03,154.07
N$55  (via drill 1 pad 1.93)
  other vias: 43.49,154.06
N$56  (via drill 1 pad 1.93)
  other vias: 46.04,156.61
N$57  (via drill 1 pad 1.93)
  other vias: 43.49,156.61
N$58  (via drill 1 pad 1.93)
  other vias: 46.04,159.15
N$59  (via drill 1 pad 1.93)
  other vias: 43.5,159.14
N$60
  Bottom 0.813: X11.3 27.67,105.44 26,107.11 26,116.75 27.7,118.45 36.87,118.45 41.21,114.1 44.25,114.1 OK1.2 45.75,112.6 45.75,103.61 44.77,102.63 OK2.2
  Bottom 1.016: X11.4 X11.3
N$61
  Bottom 0.813: X13.7 X13.8 61.13,113.91 60.78,113.91 56.13,109.25 R12.1 56.04,108.13 56.04,103.97 54.7,102.63 OK2.3
N$62
  Bottom 0.813: X13.10 X13.9
N$63
  Bottom 0.813: R13.2 38.95,95.46 OK3.1
N$64
  Bottom 0.813: R14.2 42.52,81.46 OK4.1
N$65
  Bottom 0.813: X12.4 32.21,81.04 32.71,80.54 32.71,80.89 X12.3 34.95,81.04 38,77.99 43.46,77.99 | 43.46,77.99 OK4.2 | 43.46,77.99 44.8,77.99 45.47,78.65 45.47,86.41 OK3.2
N$66
  Bottom 0.813: X14.6 X14.5 64.74,84.1 65.88,84.1 66.52,84.74 66.52,90.94 65.79,91.67 61.42,91.67 55.98,86.22 R15.1 53.14,88.12 OK3.3
N$67
  Bottom 0.813: X14.7 X14.8 62.03,86.57 60.96,86.57 58.69,84.29 58.69,83.01 57.04,81.36 56.11,81.36 | OK4.3 53.83,77.69 56.11,79.97 56.11,81.36 | 56.11,81.36 R16.1
N$68
  Bottom 0.813: X14.9 X14.10
N$69
  Bottom 0.813: OK5.1 43.73,63.26 R17.2
N$70
  Bottom 0.813: R18.2 40.85,53.46 OK6.1
N$71
  Bottom 0.813: X15.2 X15.1
N$72
  Bottom 0.813: X15.6 X15.5 33.1,56.32 34.93,56.32 36.15,57.54 R17.1
N$73
  Bottom 0.813: X15.7 X15.8 30.26,58.56 29.12,58.56 27.18,56.63 27.18,48.46 32.34,43.3 R18.1
N$74
  Bottom 0.813: X15.10 X15.9
N$75
  Bottom 0.813: X15.4 X15.3 32.93,53.42 35.29,53.42 40.69,48.02 OK6.2 44.65,48.02 45.57,48.94 45.57,58.9 OK5.2
N$76
  Bottom 0.813: X16.5 X16.6 65.53,54.14 67.17,55.78 67.17,59.96 64.87,62.26 61.29,62.26 R20.1 52.77,60.72 OK5.3
N$77
  Bottom 0.813: X16.7 X16.8 60.47,56.68 R19.1 56.4,52.17 56.4,49.61 54.81,48.02 OK6.3
N$78
  Bottom 0.813: X16.10 X16.9
N$79
  Bottom 0.813: R21.2 84.06,117.77 86.1,119.81 86.1,124.45 87.12,125.47 89.99,125.47 OK7.1
N$80
  Bottom 0.813: R22.2 87.89,114.91 OK8.1
N$81
  Bottom 0.813: X17.2 X17.1
N$82
  Bottom 0.813: X17.6 X17.5 78.23,117.33 79.89,117.33 83.98,121.42 R21.1
N$83
  Bottom 0.813: X17.7 X17.8 75.3,119.47 74.69,119.47 72.98,117.77 72.98,110.27 74.07,109.19 81.05,109.19 84.32,105.92 R22.1
N$84
  Bottom 0.813: X17.10 X17.9
N$85
  Bottom 0.813: X17.4 X17.3 79.63,114.63 83.95,110.31 89.95,110.31 OK8.2 90.06,110.2 90.84,110.2 91.86,111.22 91.86,121.74 90.65,122.95 OK7.2
N$86
  Bottom 0.813: X18.6 X18.5 111.76,118.64 113.54,118.64 113.94,119.05 113.94,124.76 112.86,125.84 105.67,125.84 102.24,122.41 R24.1 97.63,122.25 OK7.3
N$87
  Bottom 0.813: X18.7 X18.8 108.99,121.06 108.36,121.06 105.88,118.58 105.88,115.55 103.94,113.61 R23.1 102.34,113.52 102.34,111.57 101.02,110.25 OK8.3
N$88
  Bottom 0.813: X18.10 X18.9
N$89
  Bottom 0.813: R25.1 77.17,26.58 80.04,29.45 80.04,33.69 X19.1
N$90
  Bottom 0.813: R25.2 85.75,34.91 88.56,37.72 91.39,37.72 OK9.1
N$91
  Bottom 0.813: R26.1 75.59,22.62 73.55,24.66 73.55,30.17 X19.2
N$92
  Bottom 0.813: X19.3 81.48,36.44 83.2,34.72 83.2,26.03 R27.1
N$93
  Bottom 0.813: R28.1 74.62,14.34 72.09,16.87 72.09,32.69 75.66,36.26 77.1,36.26 X19.4
N$94
  Bottom 0.813: R28.2 91.45,14.34 OK12.1
N$95
  Bottom 0.813: OK11.1 89.99,22.66 R27.2
N$96
  Bottom 0.813: OK10.1 88.39,30.01 87.91,29.53 87.91,24.66 R26.2
N$97
  Bottom 0.813: OK12.2 92.33,11.77 93.33,12.76 93.33,20.24 | 93.33,20.24 93.33,27.44 | 93.33,27.44 93.33,35.49 | 93.33,35.49 93.33,41.78 | 93.33,41.78 93.33,49.3 | 93.33,49.3 93.33,56.39 | 93.33,56.39 93.33,62.81 92.39,63.75 91.58,63.75 OK13.2 91.34,64 83.67,64 83.32,64.35 83.25,64.35 77.72,69.87 72.54,69.87 71.84,69.18 71.84,64.98 72.61,64.21 76.67,64.21 77.3,63.58 77.3,60.15 76.18,59.03 72.68,59.03 72.12,58.47 72.12,55.18 72.89,54.41 75.06,54.41 76.32,53.15 76.32,48.04 79.82,44.54 X19.9 | OK14.2 93.29,56.43 93.33,56.39 | OK15.2 93.11,49.08 93.33,49.3 | OK16.2 93.28,41.73 93.33,41.78 | OK9.2 92.92,35.09 93.33,35.49 | OK10.2 93.3,27.47 93.33,27.44 | OK11.2 93.21,20.12 93.33,20.24
N$98
  Bottom 0.813: X20.1 113.82,26.43 110.21,22.81 110.21,22.78 107.43,20 106.72,20 105.23,21.49
N$99
  Bottom 0.813: OK10.3 100.71,27.47 104.01,24.16 106.88,24.16 | 106.88,24.16 107.29,24.16 R31.1 | X20.2 111.28,28.57 106.88,24.16
N$100
  Bottom 0.813: OK11.3 102.1,20.12 103.93,18.28 111.04,18.28 | 111.04,18.28 112.45,18.28 114.8,20.63 114.8,24.79 116.61,26.59 116.61,34.4 115.3,35.71 113.88,35.71 X20.3 | R30.1 110.14,12.31 111.09,13.26 111.09,18.23 111.04,18.28
N$101  (via drill 0.6 pad 1.93)  (1 unrouted)
  Bottom 0.813: OK12.3 99.14,11.81 101.92,11.81 106.16,16.06 R29.1 103.58,16.06 102.47,17.16 | X20.4 110.6,35.77 108.84,34.01 108.84,28.81 107.27,27.24 103.97,27.24 | 103.97,27.24 103.73,27.48 | 103.97,27.24 103.97,27.32 v102.87,28.42
N$102
  Bottom 0.813: R38.2 90.85,67.02 OK13.1
N$103
  Bottom 0.813: R39.2 85.82,61.94 88.71,59.05 91.47,59.05 OK14.1
N$104
  Bottom 0.813: R37.2 84.47,57.1 89.97,51.6 91.53,51.6 OK15.1
N$105
  Bottom 0.813: R40.2 84.14,51.68 OK16.1
N$106
  Bottom 0.813: R38.1 78.27,67.02 80.03,65.26 80.03,50.56 83.46,47.13 83.46,39.99 82.34,38.87 82.23,38.98 X19.5
N$107
  Bottom 0.813: 77.2,39.07 X19.6 77.27,39 74.65,39 70.47,43.18 70.47,60.89 71.52,61.94 R39.1
N$108
  Bottom 0.813: R37.1 76.85,57.1 78.14,55.81 78.14,49.79 81.57,46.36 81.57,42.3 80.87,41.6 79.9,41.6 X19.7
N$109
  Bottom 0.813: X19.8 75.08,41.52 73.58,43.02 73.58,52.26 R40.1
N$110
  Bottom 0.813: X20.7 114.56,40.85 116.13,42.42 116.13,45.93 114.04,48.02 110.84,48.02 110.02,48.84 110.02,53.73 R35.1 104.83,53.19 104.83,51.08 102.83,49.08 OK15.3
N$111
  Bottom 0.813: 110.41,41.73 X20.8 107.69,44.44 R36.1 106.29,50.74 106.28,50.74 103.77,48.23 103.77,48.22 102.41,46.86 102.41,43.09 101.15,41.83 99.28,41.83 OK16.3
N$112  (1 unrouted)
  Bottom 0.813: OK14.3 102.13,56.43 105.93,60.24 107.55,60.24 R34.1 | X20.6 108.88,38.31 104.68,42.52 104.68,45.51 104.36,45.83
N$113
  Bottom 0.813: X20.5 115.67,38.31 117.84,40.49 117.84,47.72 115.53,50.03 112.93,50.03 112.03,50.93 112.03,61.24 R33.1 106.01,63.78 OK13.3
N$114
  Bottom 1.016: J1.1 10,103.9 C10.+ 6.14,97.5 IC1.1
N$115
  Bottom 0.813: LED1.A 29.05,125.47 27.67,126.85 23.86,126.85 22.34,125.33 22.34,122.04 R41.1
N$116
  Bottom 0.813: X13.6 X13.5 64.02,111.45 65.98,111.45 67.16,112.63 67.16,118.56 65.61,120.11 60.6,120.11 56.29,115.8 R10.1 55.96,114.06 OK1.3
N$117
  Bottom 0.813: X21.2 X21.1
N$118
  Bottom 0.813: X21.6 X21.5 34.27,26.34 35.85,27.92 38.47,27.92 R42.1
N$119
  Bottom 0.813: X21.7 X21.8 29.34,28.9 28.36,28.9 25.99,26.54 25.99,20.67 27.67,18.99 33.89,18.99 38.09,14.79 R43.1
N$120
  Bottom 0.813: X21.10 X21.9
N$121
  Bottom 0.813: R42.2 39.94,38.47 OK17.1
N$122
  Bottom 0.813: R43.2 40.79,24.95 OK18.1
N$123
  Bottom 0.813: OK17.2 45.26,31.64 46.65,30.24 46.65,20.69 45.23,19.26 43.98,19.26 OK18.2 43.89,19.17 39.78,19.17 35.16,23.8 X21.3 X21.4
N$124
  Bottom 0.813: X22.6 X22.5 65.3,26.49 67.36,26.49 68.61,27.74 68.61,33.1 67.09,34.62 59.24,34.62 56.69,32.07 | R44.1 56.69,32.07 | OK17.3 56.26,31.64 56.69,32.07
N$125
  Bottom 0.813: OK18.3 54.84,19.24 56.83,21.23 56.76,21.29 R45.1 61.83,28.99 62.72,28.99 X22.8 X22.7
N$126
  Bottom 0.813: X22.10 X22.9
N$127
  Bottom 0.813: X23.2 X23.1
N$128
  Bottom 0.813: X23.6 X23.5 82.29,87.24 R46.1
N$129
  Bottom 0.813: R47.1 74.95,73.35 72,76.31 72,87.26 X23.8 X23.7
N$130
  Bottom 0.813: X23.10 X23.9
N$131
  Bottom 0.813: R46.2 85.19,99.42 OK19.1
N$132
  Bottom 0.813: R47.2 88.16,83.51 OK20.1
N$133
  Bottom 0.813: X23.4 X23.3 79.76,84.7 85.84,78.63 90.12,78.63 OK20.2 91.64,78.81 92.18,79.34 92.18,91.48 91.54,92.12 OK19.2
N$134
  Bottom 0.813: OK19.3 100.48,92.12 R48.1 103.34,90.95 106.99,94.61 114.22,94.61 115.2,93.62 115.2,89.25 113.33,87.38 111.89,87.38 X24.5 X24.6
N$135
  Bottom 0.813: OK20.3 101.74,78.82 103.42,80.5 103.42,84.58 R49.1 104.04,84.69 106.63,87.29 106.63,88.36 108.24,89.96 109.25,89.96 X24.8 X24.7
N$136
  Bottom 0.813: X24.10 X24.9
N$137
  Bottom 0.813: J3.1 9.74,44.52 6.46,41.23 6.46,36.26 IC2.1 6,35.8 4.13,35.8 3.35,35.03 3.35,19.06 C11.+
N$149
  Bottom 0.813: J2.1 92.74,182.84 90.57,180.67 90.57,173.42 92.69,171.3 95.06,171.3 X25.10
N$150
  Bottom 0.813: X25.9 95.31,176.67 98.82,180.17 98.82,182.71 J2.2 99.02,183.18 99.02,187.29 100.32,188.58 108.59,188.58 112.84,184.33 112.84,169.93 110.72,167.81 105.4,167.81 103.16,165.56 98.08,165.56 95.76,163.24 OK21.2
N$151
  Bottom 0.813: J2.3 101.22,185.08 102.69,186.54 107.56,186.54 109.44,184.67 109.44,173.42 107.56,171.55 X25.2
N$152
  Bottom 0.813: J2.4 105.02,182.84 107.31,180.54 107.31,175.93 X25.1
N$153
  Bottom 0.813: R50.2 99.92,158.2 98.91,157.18 98.91,157.15 OK21.1
N$154
  Bottom 0.813: R50.1 92.3,165.81 94.06,167.57 100.44,167.57 103.28,170.4 103.28,171.21 X25.4
N$155
  Bottom 0.813: R53.1 44.62,11.37 47.99,8 68.56,8 70.11,9.55 70.11,11.35 LED2.A
N$156
  Bottom 0.813: OK21.3 95.76,144.95 R52.1 92.39,136.33 R51.1
N$157
  Bottom 0.813: R52.2 108.46,141.58 112.84,145.97 112.84,149.81 Q9.B
N$159
  Bottom 0.813: X26.2 112.69,163.81 114.43,162.07 114.43,158.08 110.28,153.94 110.28,150.34 Q9.C
N$160
  Bottom 0.813: C1.- 59.65,140.59 62.84,143.78 | Q1.E 64.26,145.21 62.84,143.78 | 57.72,165.99 C5.- | 64.62,170.46 60.16,165.99 57.72,165.99 | Q5.E 64.77,170.31 64.62,170.46 | 67.41,183.35 67.41,184.09 64.62,186.88 54.95,186.88 53.32,185.25 53.32,182.73 | 67.41,183.35 Q7.E | 58.68,153.29 C3.- | 58.68,153.29 63.04,157.66 | 63.04,157.66 63.6,158.22 67.35,158.22 Q3.E | 57.72,165.99 57.6,165.87 57.6,163.1 63.04,157.66 | 58.68,153.29 58.68,147.94 62.84,143.78 | 29.7,183.17 29.2,183.17 | 29.2,183.17 Q8.E | 29.7,183.17 31.38,183.17 C8.- 35.81,180.97 45.17,180.97 47.39,178.76 X1.1 47.41,178.11 47.41,180.66 49.55,182.8 53.24,182.8 53.32,182.73 | 29.1,170.31 Q6.E | 29.1,170.31 31.22,170.31 C7.- 31.88,172.2 31.88,175.41 29.4,177.88 29.4,182.97 29.2,183.17 | 29.39,158.48 Q4.E | 29.39,158.48 32.08,158.48 C4.- 32.22,159.15 32.22,162.58 29.2,165.6 29.2,170.21 29.1,170.31 | Q2.E 32.13,145.82 C2.- 32.49,149.3 29.6,152.2 29.6,158.27 29.39,158.48 | 29.7,183.17 29.29,182.76 | 53.32,182.73 C6.- | 64.62,170.46 68.99,170.46 70.67,172.13 70.67,178.8 72.67,180.8 77.45,180.8 78,180.24 85.34,180.24 87.22,182.13 87.22,186.02 83.35,189.89 | 83.35,189.89 83.11,190.13 69.22,190.13 67.22,188.13 67.22,183.54 67.41,183.35 | Q9.E 104.45,150.09 97.51,143.15 97.51,139.33 98.18,138.67 112.77,138.67 115.92,141.82 115.92,187.13 112.27,190.78 84.24,190.78 83.35,189.89
N$162  (1 unrouted)
  Bottom 0.813: OK9.3 102.11,35.09 105.78,31.42
N$165  (via drill 0.6 pad 1.93)  (1 unrouted)
  Bottom 0.813: D10.A 16.78,51.43 J3.2 15.66,51.43 15.77,51.32 15.77,46.8 | 15.77,46.8 15.77,35.16 14.61,33.99 14.61,33.86 14.09,33.35 | 14.09,33.35 6.13,33.35 IC2.2 | 14.09,33.35 14.09,33.6 15.64,35.16 15.64,46.67 15.77,46.8 | 15.77,46.8 20.82,46.8 23.41,44.21 23.41,17.05 | R33.2 R34.2 117.91,56.12 R35.2 R36.2 117.94,52.14 119.53,50.55 119.53,26.25 R31.2 117.73,20.17 R32.2 | R32.2 R29.2 117.65,12.46 | R32.2 | 118.11,11.75 117.8,12.06 R30.2 117.65,12.46 | 117.65,12.46 114.29,12.46 110.86,9.03 98.31,9.03 92.62,3.34 24.83,3.34 v23.14,5.03 | LED2.K 61.89,11.43 60.02,9.55 49.67,9.55 45.66,13.56 41.26,13.56 38.8,11.1 37.25,11.1 31.3,17.05 23.41,17.05 | 23.41,17.05 23.28,16.92 23.14,17.06 21.64,17.06 C11.- | 23.41,17.05
N$172  (via drill 0.6 pad 1.93)
  other vias: 104.32,45.82
N$173  (via drill 0.6 pad 1.93)
  other vias: 103.89,58.19
N$174  (via drill 0.6 pad 1.93)
  other vias: 105.38,21.57
N$175  (via drill 0.6 pad 1.93)
  other vias: 102.71,16.85
N$176  (via drill 0.6 pad 1.93)
  other vias: 105.78,31.34
N$177  (via drill 0.6 pad 1.93)
  other vias: 23.54,16.92
N$178  (via drill 0.6 pad 1.93)
  other vias: 58.09,42.36
N$179  (via drill 0.6 pad 1.93)
  other vias: 67.44,42.44
VCC
  Bottom 0.813: 14.32,70.93 20.23,70.93 D1.C | OK1.4 51.84,116.53 50.95,116.53 49.92,115.51 49.92,106.81 51.56,105.17 OK2.4 49.89,103.15 49.89,101.51 51.19,100.22 57.53,100.22 58.6,99.15 | OK4.4 50.77,80.23 | 50.77,80.23 49.51,81.49 49.51,89.7 50.49,90.68 51.35,90.68 OK3.4 56.83,90.66 58.94,92.77 58.94,97.82 | OK6.4 49.22,52.71 49.22,62.37 50.12,63.26 OK5.4 60.98,63.26 64.83,67.11 | OK7.4 97.62,125.48 96.72,125.48 95.08,123.83 95.08,113.82 96.11,112.79 OK8.4 96.18,112.79 95.04,111.65 95.04,106.62 | 58.94,97.82 58.94,98.81 58.6,99.15 | R41.2 22.7,85.82 25.84,82.69 25.84,58.68 | 25.84,58.41 25.84,58.34 23.97,56.47 | 23.97,56.47 12.07,56.47 11.73,56.81 11.56,56.81 10.2,58.17 10.2,66.81 C9.+ | 25.84,58.68 24.14,56.98 | X13.1 X13.2 61.76,106.5 62.15,106.89 60.6,106.89 58.69,104.98 58.69,99.23 58.6,99.15 | X16.2 X16.1 | X14.2 X14.1 60.78,78.9 56.11,74.23 51.86,74.23 49.34,76.65 49.34,79.1 50.77,80.23 | X18.1 X18.2 107.7,113.39 101.23,106.91 95.33,106.91 95.04,106.62 | OK18.4 50.39,21.78 | 50.39,21.78 49.6,22.56 49.6,33.19 50.4,33.99 51.67,33.99 OK17.4 51.86,34.24 45.38,40.72 | X22.1 X22.2 62.74,14.64 59.15,11.05 50.22,11.05 48.97,12.3 48.97,20.36 50.39,21.78 | X24.1 X24.2 109.33,77.21 103.26,71.14 97.36,71.14 94.95,73.56 | 22.99,55.49 23.97,56.47 | 25.84,58.68 25.84,58.41 | 25.84,58.41 22.89,55.46 22.89,48.74 30.91,40.72 45.38,40.72 | 95.04,106.62 95.04,94.44 | 95.04,94.44 95.04,82.93 96.78,81.19 96.98,81.19 | 96.98,81.19 97.77,81.19 OK20.4 | OK19.4 95.26,94.66 95.04,94.44 | 94.95,73.56 94.95,79.16 96.98,81.19 | 64.83,67.11 69.44,71.72 | 69.44,71.72 69.44,94.93 66.35,98.02 59.14,98.02 58.94,97.82
  Bottom 0.813: 94.95,73.56 92.73,73.56 90.02,70.85 80.07,70.85 79.29,71.62 69.54,71.62 69.44,71.72 | X16.2 66.02,49.06 68.75,51.79 68.75,63.19 64.83,67.11 | 45.38,40.72 45.47,40.72 47.19,39 52.85,39 53.83,39.98 59.16,39.98 62.19,43.01 62.19,48.91 X16.2 | OK21.4 98.3,150.8 96.85,152.24 93.04,152.24 89.49,148.69 89.49,138.94 82.23,131.68 33.26,131.68 30.21,128.63 7.37,128.63 2.55,123.8 2.55,83.41 4.07,81.88 5.08,81.88 5.34,82.14 6.1,82.14 IC1.3
  Bottom 1.016: IC1.3 6.14,72.47 C9.+ 14.32,70.93
VDD
  Bottom 0.813: D10.C 19.06,26.15 16.81,23.91 12.45,23.91 | 12.45,23.91 9.56,23.91 6.46,27.01 6.46,30.48 IC2.3 | 96.37,14.72 96.37,9.94 92.1,5.67 35.18,5.67 32.49,8.37 R53.2 22.74,11.37 17.95,6.58 14.31,6.58 13.13,7.75 13.13,23.23 12.45,23.91 | 96.37,14.72 96.37,22.74 | 96.37,22.74 96.37,30.11 | 96.37,30.11 96.37,37.87 | 96.37,37.87 96.37,44.47 | 96.37,44.47 96.37,51.97 | 96.37,51.97 96.37,59.08 | 96.37,59.08 96.37,64.64 98.05,66.32 OK13.4 | OK14.4 96.48,58.97 96.37,59.08 | OK15.4 96.72,51.62 96.37,51.97 | OK16.4 96.57,44.27 96.37,44.47 | OK9.4 96.62,37.63 96.37,37.87 | OK10.4 96.48,30.01 96.37,30.11 | OK11.4 96.46,22.66 96.37,22.74 | OK12.4 96.79,14.31 96.37,14.72

### Text on the board
Bottom: TR SKNCOE